# Altium schematic sheet Com.SchDoc: OpenSCB: COM
size A4; Organization: OpenSCB; Revision: 0.2; SheetNumber: 4; SheetTotal: 4
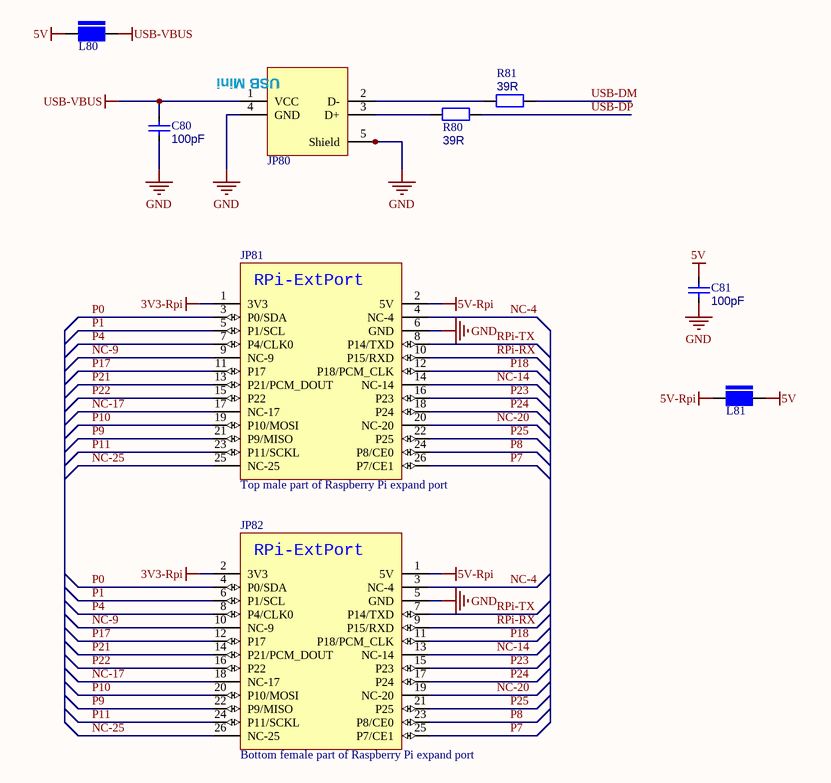
[diagram p0: Com.SchDoc]

## Parts
C80  value 100pF  [CC1005-0402]  (hidden comment: Condensateur)
C81  value 100pF  [CC1005-0402]  (hidden comment: Condensateur)
JP80  USB Mini-B SMD  [UX60SC-MB-5ST]  (value not drawn)
JP81  Top male part of Raspberry Pi expand port  [2x13 pins SMT male header]
JP82  Bottom female part of Raspberry Pi expand port  [2x13 pins SMT female header]
L80  Ferrite  [CR1608-0603]  (value not drawn)
L81  Ferrite  [CR1608-0603]  (value not drawn)
R80  value 39R  [CR1005-0402]  (hidden comment: Resistance)
R81  value 39R  [CR1005-0402]  (hidden comment: Resistance)

## Nets
3V3-Rpi: JP81.1(3V3) JP82.2(3V3)
5V: C81.2 L80.1 L81.2
5V-Rpi: JP81.2(5V) JP82.1(5V) L81.1
GND: C80.1 C81.1 JP80.4(GND) JP80.5(Shield) JP80.6(Shield) JP80.7(Shield) JP81.6(GND) JP82.5(GND)
USB-VBUS: C80.2 JP80.1(VCC) L80.2
NC-4: JP81.4(NC-4) JP82.3(NC-4)
NC-9: JP81.9(NC-9) JP82.10(NC-9)
NC-14: JP81.14(NC-14) JP82.13(NC-14)
NC-17: JP81.17(NC-17) JP82.18(NC-17)
NC-20: JP81.20(NC-20) JP82.19(NC-20)
NC-25: JP81.25(NC-25) JP82.26(NC-25)
P0: JP81.3(P0/SDA) JP82.4(P0/SDA)
P1: JP81.5(P1/SCL) JP82.6(P1/SCL)
P4: JP81.7(P4/CLK0) JP82.8(P4/CLK0)
P7: JP81.26(P7/CE1) JP82.25(P7/CE1)
P8: JP81.24(P8/CE0) JP82.23(P8/CE0)
P9: JP81.21(P9/MISO) JP82.22(P9/MISO)
P10: JP81.19(P10/MOSI) JP82.20(P10/MOSI)
P11: JP81.23(P11/SCKL) JP82.24(P11/SCKL)
P17: JP81.11(P17) JP82.12(P17)
P18: JP81.12(P18/PCM_CLK) JP82.11(P18/PCM_CLK)
P21: JP81.13(P21/PCM_DOUT) JP82.14(P21/PCM_DOUT)
P22: JP81.15(P22) JP82.16(P22)
P23: JP81.16(P23) JP82.15(P23)
P24: JP81.18(P24) JP82.17(P24)
P25: JP81.22(P25) JP82.21(P25)
RPi-RX: JP81.10(P15/RXD) JP82.9(P15/RXD)
RPi-TX: JP81.8(P14/TXD) JP82.7(P14/TXD)
USB-DM: R81.2
USB-DP: R80.2
NetJP80_2: JP80.2(D-) R81.1
NetJP80_3: JP80.3(D+) R80.1

## Notes on the sheet
- Title
- Size:
- Date:
- A4
- Number:
- Time:
- Revision:
- Sheet
- of
- File:
- (in symbol RPi-ExtPort-Bottom) RPi-ExtPort
- (in symbol RPi-ExtPort-Top) RPi-ExtPort
- (in symbol USB Mini-B SMD) USB Mini

## Library data of the parts
JP80 = USB Mini-B SMD: USB Mini, Type B, SMD
JP81 = RPi-ExtPort-Top
JP82 = RPi-ExtPort-Bottom
L80 L81 = Ferrite: Ferrite CMS
R80 R81 = Resistance: Precision: 5%; Power: 0.5W
C80 C81 = Condensateur: Revision: July-2002: Re-released for DXP Platform.